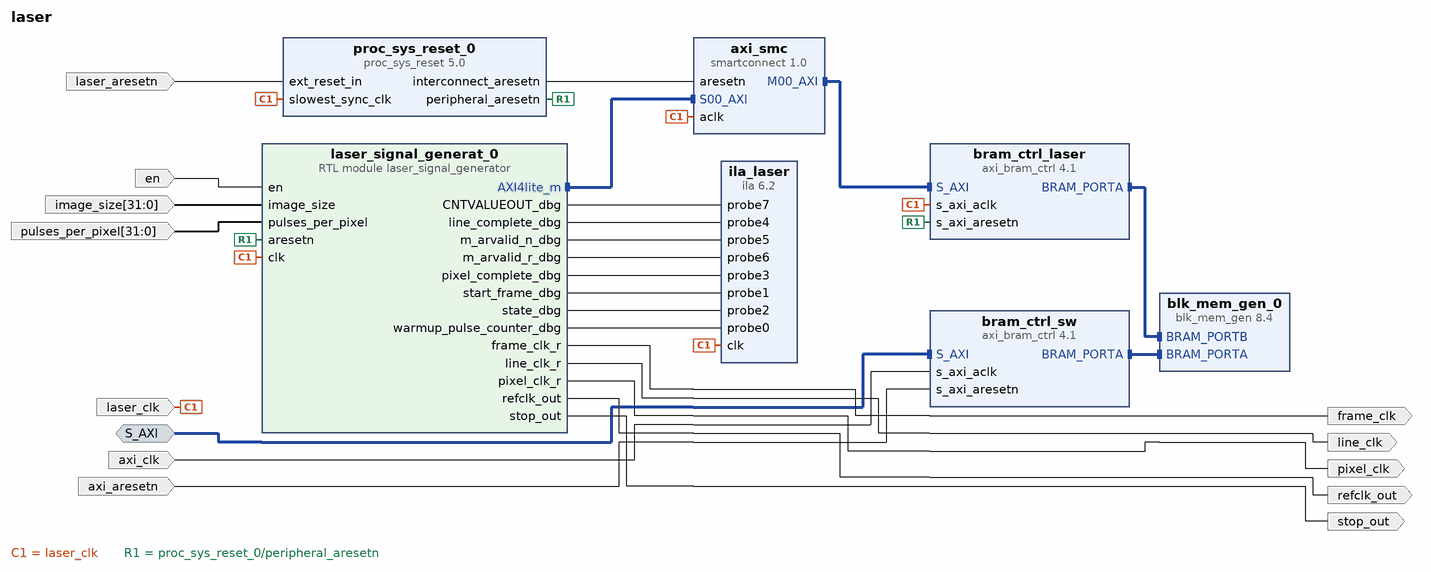
[diagram p0: block diagram of the top level]
# Vivado block design laser, xc7z020clg484-1, Vivado 2024.2
create_bd_design laser

create_bd_intf_port -mode Slave -vlnv xilinx.com:interface:aximm_rtl:1.0 S_AXI
set_property -dict [list \
  CONFIG.ADDR_WIDTH 18 \
  CONFIG.ARUSER_WIDTH 0 \
  CONFIG.AWUSER_WIDTH 0 \
  CONFIG.BUSER_WIDTH 0 \
  CONFIG.DATA_WIDTH 32 \
  CONFIG.FREQ_HZ 50000000 \
  CONFIG.HAS_BRESP 1 \
  CONFIG.HAS_BURST 0 \
  CONFIG.HAS_CACHE 0 \
  CONFIG.HAS_LOCK 0 \
  CONFIG.HAS_PROT 1 \
  CONFIG.HAS_QOS 0 \
  CONFIG.HAS_REGION 0 \
  CONFIG.HAS_RRESP 1 \
  CONFIG.HAS_WSTRB 1 \
  CONFIG.ID_WIDTH 0 \
  CONFIG.NUM_READ_OUTSTANDING 1 \
  CONFIG.NUM_READ_THREADS 1 \
  CONFIG.NUM_WRITE_OUTSTANDING 1 \
  CONFIG.NUM_WRITE_THREADS 1 \
  CONFIG.PROTOCOL AXI4LITE \
  CONFIG.READ_WRITE_MODE READ_WRITE \
  CONFIG.RUSER_BITS_PER_BYTE 0 \
  CONFIG.RUSER_WIDTH 0 \
  CONFIG.WUSER_BITS_PER_BYTE 0 \
  CONFIG.WUSER_WIDTH 0 \
] [get_bd_intf_ports S_AXI]
create_bd_port -dir I en
create_bd_port -dir O frame_clk
create_bd_port -dir I -from 31 -to 0 image_size
create_bd_port -dir O line_clk
create_bd_port -dir O pixel_clk
create_bd_port -dir I -from 31 -to 0 pulses_per_pixel
create_bd_port -dir O refclk_out
create_bd_port -dir O stop_out
create_bd_port -dir I -type clk axi_clk
set_property -dict {CONFIG.ASSOCIATED_RESET axi_aresetn CONFIG.FREQ_HZ 50000000} [get_bd_ports axi_clk]
create_bd_port -dir I -type rst axi_aresetn
create_bd_port -dir I -type clk laser_clk
set_property -dict {CONFIG.ASSOCIATED_RESET aresetn_laser:laser_aresetn CONFIG.FREQ_HZ 10000000} [get_bd_ports laser_clk]
create_bd_port -dir I -type rst laser_aresetn

create_bd_cell -type ip -vlnv xilinx.com:ip:axi_bram_ctrl:4.1 bram_ctrl_laser
set_property -dict {CONFIG.PROTOCOL AXI4LITE CONFIG.SINGLE_PORT_BRAM 1 CONFIG.USE_ECC 0} [get_bd_cells bram_ctrl_laser]
create_bd_cell -type ip -vlnv xilinx.com:ip:axi_bram_ctrl:4.1 bram_ctrl_sw
set_property -dict {CONFIG.PROTOCOL AXI4LITE CONFIG.SINGLE_PORT_BRAM 1 CONFIG.USE_ECC 0} [get_bd_cells bram_ctrl_sw]
create_bd_cell -type module -reference laser_signal_generator laser_signal_generat_0
set_property -dict {CONFIG.addr_width 18} [get_bd_cells laser_signal_generat_0]
create_bd_cell -type ip -vlnv xilinx.com:ip:blk_mem_gen:8.4 blk_mem_gen_0
set_property -dict [list \
  CONFIG.Assume_Synchronous_Clk false \
  CONFIG.EN_SAFETY_CKT false \
  CONFIG.Memory_Type True_Dual_Port_RAM \
  CONFIG.Read_Width_A 32 \
  CONFIG.Write_Width_A 32 \
  CONFIG.use_bram_block BRAM_Controller \
] [get_bd_cells blk_mem_gen_0]
create_bd_cell -type ip -vlnv xilinx.com:ip:ila:6.2 ila_laser
set_property -dict [list \
  CONFIG.C_MONITOR_TYPE Native \
  CONFIG.C_NUM_OF_PROBES 8 \
  CONFIG.C_PROBE0_WIDTH 4 \
  CONFIG.C_PROBE2_WIDTH 3 \
  CONFIG.C_PROBE7_WIDTH 5 \
  CONFIG.C_TRIGIN_EN false \
] [get_bd_cells ila_laser]
create_bd_cell -type ip -vlnv xilinx.com:ip:smartconnect:1.0 axi_smc
set_property -dict {CONFIG.NUM_SI 1} [get_bd_cells axi_smc]
create_bd_cell -type ip -vlnv xilinx.com:ip:proc_sys_reset:5.0 proc_sys_reset_0

# ---- connections ----

connect_bd_intf_net [get_bd_intf_ports S_AXI] [get_bd_intf_pins bram_ctrl_sw/S_AXI]
connect_bd_intf_net [get_bd_intf_pins axi_smc/M00_AXI] [get_bd_intf_pins bram_ctrl_laser/S_AXI]
connect_bd_intf_net [get_bd_intf_pins bram_ctrl_laser/BRAM_PORTA] [get_bd_intf_pins blk_mem_gen_0/BRAM_PORTB]
connect_bd_intf_net [get_bd_intf_pins bram_ctrl_sw/BRAM_PORTA] [get_bd_intf_pins blk_mem_gen_0/BRAM_PORTA]
connect_bd_intf_net [get_bd_intf_pins laser_signal_generat_0/AXI4lite_m] [get_bd_intf_pins axi_smc/S00_AXI]
connect_bd_net [get_bd_ports axi_clk] [get_bd_pins bram_ctrl_sw/s_axi_aclk]
connect_bd_net -net en_0_1 [get_bd_ports en] [get_bd_pins laser_signal_generat_0/en]
connect_bd_net -net image_size_0_1 [get_bd_ports image_size] [get_bd_pins laser_signal_generat_0/image_size]
connect_bd_net [get_bd_ports laser_aresetn] [get_bd_pins proc_sys_reset_0/ext_reset_in]
connect_bd_net -net laser_clk_0_1 [get_bd_ports laser_clk] \
  [get_bd_pins bram_ctrl_laser/s_axi_aclk] [get_bd_pins ila_laser/clk] [get_bd_pins axi_smc/aclk] \
  [get_bd_pins laser_signal_generat_0/clk] [get_bd_pins proc_sys_reset_0/slowest_sync_clk]
connect_bd_net [get_bd_pins laser_signal_generat_0/CNTVALUEOUT_dbg] [get_bd_pins ila_laser/probe7]
connect_bd_net [get_bd_pins laser_signal_generat_0/frame_clk_r] [get_bd_ports frame_clk]
connect_bd_net [get_bd_pins laser_signal_generat_0/line_clk_r] [get_bd_ports line_clk]
connect_bd_net [get_bd_pins laser_signal_generat_0/line_complete_dbg] [get_bd_pins ila_laser/probe4]
connect_bd_net [get_bd_pins laser_signal_generat_0/m_arvalid_n_dbg] [get_bd_pins ila_laser/probe5]
connect_bd_net [get_bd_pins laser_signal_generat_0/m_arvalid_r_dbg] [get_bd_pins ila_laser/probe6]
connect_bd_net [get_bd_pins laser_signal_generat_0/pixel_clk_r] [get_bd_ports pixel_clk]
connect_bd_net [get_bd_pins laser_signal_generat_0/pixel_complete_dbg] [get_bd_pins ila_laser/probe3]
connect_bd_net [get_bd_pins laser_signal_generat_0/refclk_out] [get_bd_ports refclk_out]
connect_bd_net [get_bd_pins laser_signal_generat_0/start_frame_dbg] [get_bd_pins ila_laser/probe1]
connect_bd_net [get_bd_pins laser_signal_generat_0/state_dbg] [get_bd_pins ila_laser/probe2]
connect_bd_net [get_bd_pins laser_signal_generat_0/stop_out] [get_bd_ports stop_out]
connect_bd_net [get_bd_pins laser_signal_generat_0/warmup_pulse_counter_dbg] [get_bd_pins ila_laser/probe0]
connect_bd_net [get_bd_pins proc_sys_reset_0/interconnect_aresetn] [get_bd_pins axi_smc/aresetn]
connect_bd_net [get_bd_pins proc_sys_reset_0/peripheral_aresetn] \
  [get_bd_pins bram_ctrl_laser/s_axi_aresetn] [get_bd_pins laser_signal_generat_0/aresetn]
connect_bd_net -net pulses_per_pixel_0_1 [get_bd_ports pulses_per_pixel] [get_bd_pins laser_signal_generat_0/pulses_per_pixel]
connect_bd_net -net s_axi_aresetn_0_1 [get_bd_ports axi_aresetn] [get_bd_pins bram_ctrl_sw/s_axi_aresetn]

# ---- address map ----
assign_bd_address -offset 0x00000 -range 256K -target_address_space [get_bd_addr_spaces laser_signal_generat_0/AXI4lite_m] [get_bd_addr_segs bram_ctrl_laser/S_AXI/Mem0]
assign_bd_address -offset 0x00000 -range 256K -target_address_space [get_bd_addr_spaces S_AXI] [get_bd_addr_segs bram_ctrl_sw/S_AXI/Mem0]

validate_bd_design
save_bd_design
